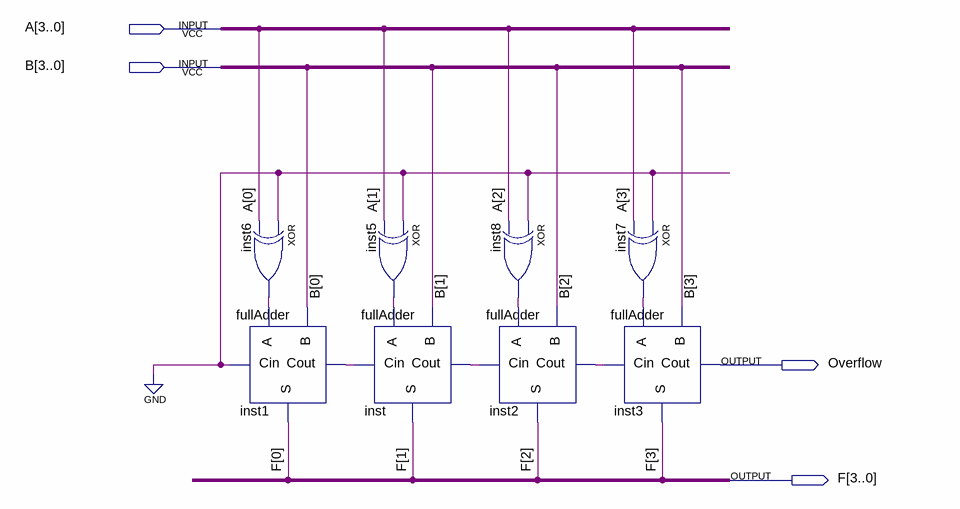
[diagram p0: schematic sheet]
// Quartus schematic Somador4Bits_2.bdf as structural Verilog: 8 symbols, 4 pins
module Somador4Bits_2 (
  input  [3:0] A,
  input  [3:0] B,
  output Overflow,
  output [3:0] F
);

  wire inst1_cout, inst2_cout, inst5_out, inst6_out, inst7_out, inst8_out, inst_cout;

  xor inst6 (inst6_out, 1'b0, A[0]);
  fullAdder inst1 (.A(inst6_out), .B(B[0]), .Cin(1'b0), .S(F[0]), .Cout(inst1_cout));
  xor inst5 (inst5_out, 1'b0, A[1]);
  fullAdder inst (.A(inst5_out), .B(B[1]), .Cin(inst1_cout), .S(F[1]), .Cout(inst_cout));
  xor inst8 (inst8_out, 1'b0, A[2]);
  fullAdder inst2 (.A(inst8_out), .B(B[2]), .Cin(inst_cout), .S(F[2]), .Cout(inst2_cout));
  xor inst7 (inst7_out, 1'b0, A[3]);
  fullAdder inst3 (.A(inst7_out), .B(B[3]), .Cin(inst2_cout), .S(F[3]), .Cout(Overflow));
endmodule
